# Altium schematic sheet Sch_SD.SchDoc: Control de Domótica
size A4; Author: Francisco González González - Eugenia Ipar; CompanyName: Conexión a Tarjeta SD; DocumentNumber: 11; SheetNumber: 11; SheetTotal: 12; Materia: Técnicas Digitales II; Placa: Conexión a SD Card; Year: 2015; Prof1: Prof: Alarcón, Juan; Prof2: Ayud: Crivelli, Marcelo; Prof3: Ayud: Montalti, Pablo; PageSetup: Record=PageOptions|CenterHorizontal=True|CenterVertical=True|PrintScale=1.00|XCorrection=1.00|YCorrection=1.00|PrintKind=0|BorderSize=5000000|LeftOffset=0|BottomOffset=0|Orientation=2|PaperLength=1000|PaperWidth=1000|Scale=100|PaperSource=7|PrintQuality=-3|MediaType=1|DitherType=10|PrintScaleMode=1|PaperKind=A4|PaperIndex=9
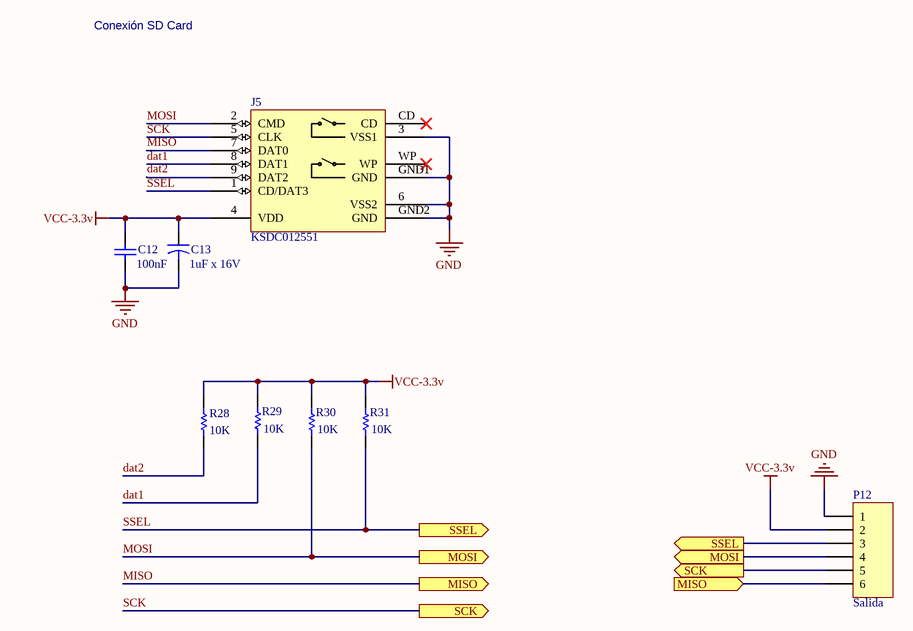
[diagram p0: Sch_SD.SchDoc]

## Parts
C12  value 100nF  [RAD-0.3]  (hidden comment: Cap)
C13  value 1uF x 16V  [CAPR5-4X5]  (hidden comment: Cap2)
J5  KSDC012551  [KONV-KSDC012551_V]
P12  Salida  [HDR1X6]
R28  value 10K  [AXIAL-0.3]  (hidden comment: Res1)
R29  value 10K  [AXIAL-0.3]  (hidden comment: Res1)
R30  value 10K  [AXIAL-0.3]  (hidden comment: Res1)
R31  value 10K  [AXIAL-0.3]  (hidden comment: Res1)

## Ports
MISO (in), MISO (out), MOSI (out), SCK (out), SSEL (out)

## Nets
GND: C12.1 C13.2 J5.3(VSS1) J5.6(VSS2) J5.GND1(GND) J5.GND2(GND) P12.1
VCC-3.3v: C12.2 C13.1 J5.4(VDD) P12.2 R28.2 R29.2 R30.2 R31.2
dat1: J5.8(DAT1) R29.1
dat2: J5.9(DAT2) R28.1
MISO: J5.7(DAT0) P12.6 ; port MISO
MOSI: J5.2(CMD) P12.4 R30.1 ; port MOSI
SCK: J5.5(CLK) P12.5 ; port SCK
SSEL: J5.1(CD/DAT3) P12.3 R31.1 ; port SSEL

Not connected (* = marked no-connect by the designer): J5 CD* WP*

## Notes on the sheet
- Conexión SD Card
- Sheet
- of

## Library data of the parts
C12 = Cap: Capacitor; Published: 8-Jun-2000; LatestRevisionDate: 17-Jul-2002; LatestRevisionNote: Re-released for DXP Platform.; PackageReference: RAD-0.3; Publisher: Altium Limited; PackageDescription: Radial Cap, Thru-Hole; 2 Leads; 0.3 in Pin Spacing
C13 = Cap2: Capacitor; Published: 23-Sep-2002; PackageReference: CAPR5-4X5; Publisher: Altium Limited; PackageDescription: Capacitor; 2 Leads
J5 = CMP-0408-00001-2: Secure Digital Card Socket; Manufacturer: Konvee Electronic; ComponentLink1URL: http://www.konvee.com/; PackageReference: KSDC012551; ComponentLink1Description: Manufacturer URL; PackageDescription: SD Card Socket; PartNumber: KSDC012551
P12 = Header 6: Header, 6-Pin; LatestRevisionDate: 17-Jul-2002; LatestRevisionNote: Re-released for DXP Platform.; Publisher: Altium Limited
R28-R31 = Res1: Resistor; Published: 8-Jun-2000; LatestRevisionDate: 17-Jul-2002; LatestRevisionNote: Re-released for DXP Platform.; PackageReference: AXIAL-0.3; Publisher: Altium Limited; PackageDescription: Axial Device, Thru-Hole; 2 Leads; 0.3 in Pin Spacing